# EAGLE design LB-w4-DOUBLE_AND_v02(rev2) (EAGLE 6.6.0)
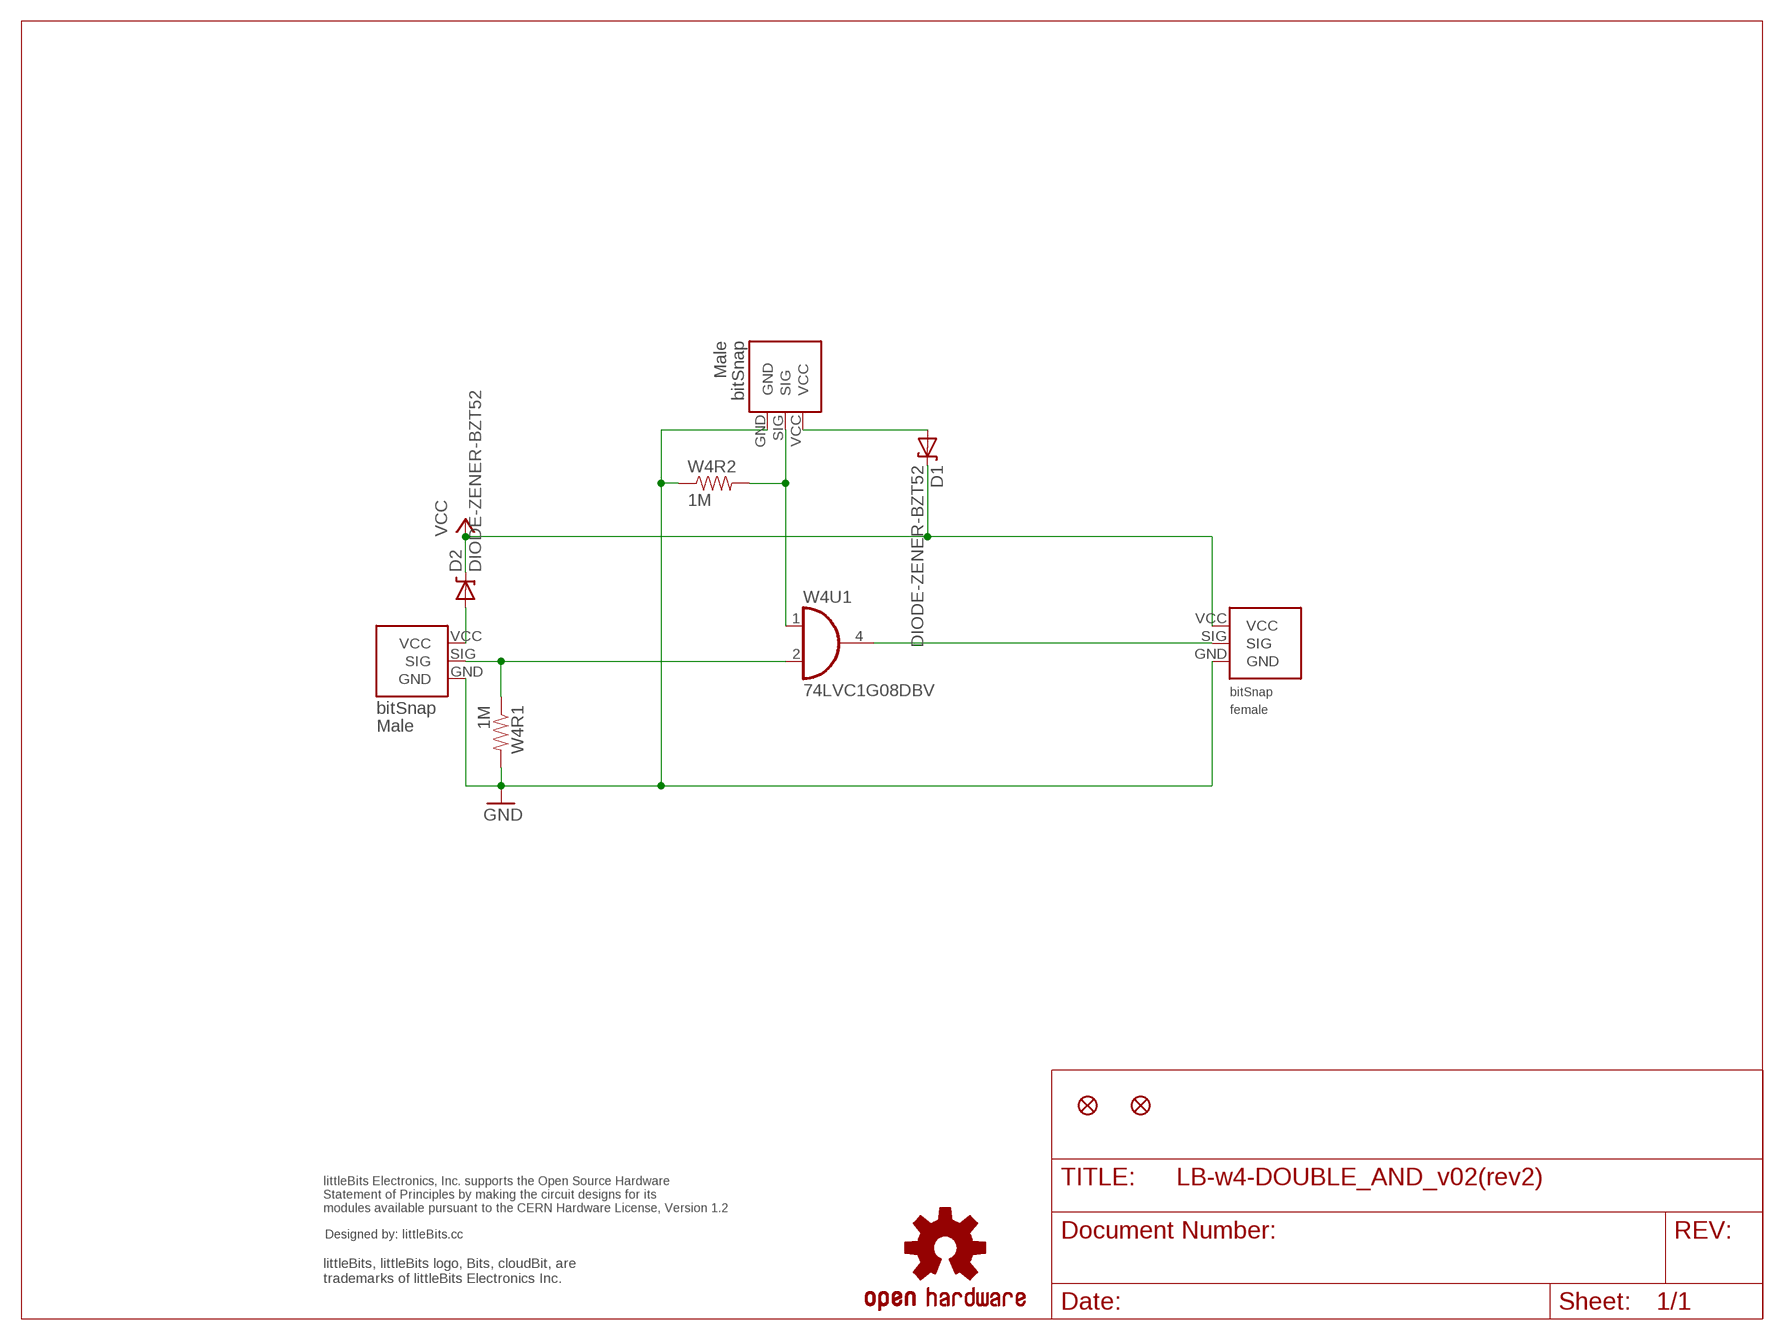
[diagram p0: schematic, sheet 1]

## Parts
D1  DIODE-ZENER-BZT52  [SOD-323]
D2  DIODE-ZENER-BZT52  [SOD-323]
U$1  OSHW-LOGOL  [OSHW-LOGO-L]
U$2  OSHWCREDIT  [OSHWCREDIT]
W4BSF  BITSNAP_FEMALE  [BITSNAP_FEMALE]
W4BSM1  BITSNAP_MALE  [BITSNAP_MALE]
W4BSM2  BITSNAP_MALE  [BITSNAP_MALE]
W4FD1  FIDUCIAL1X2  [FIDUCIAL-1X2]
W4FD2  FIDUCIAL1X2  [FIDUCIAL-1X2]
W4R1  1M  RESISTOR0603-RES  [0603-RES]
W4R2  1M  RESISTOR0603-RES  [0603-RES]
W4U1  74LVC1G08DBV  [SOT23-5]

## Nets
GND: W4BSF.GND W4BSM1.GND W4BSM2.GND W4R1.2 W4R2.1
N$1: W4BSF.SIG W4U1.4(O)
N$2: D1.2(A) W4BSM2.VCC
N$3: D2.2(A) W4BSM1.VCC
N$6: W4BSM2.SIG W4R2.2 W4U1.1(I0)
N$11: W4BSM1.SIG W4R1.1 W4U1.2(I1)
VCC: D1.1(C) D2.1(C) W4BSF.VCC

## Power pins joined to a net without a drawn wire
GND: W4U1.3(GND)
VCC: W4U1.5(VCC)

## Library data of the parts
D1 D2 = SparkFun:DIODE-ZENER: Zener Diode Production Part - 8199 3.4V Zener Voltage
U$1 = SparkFun_NEW:OSHW-LOGO: Open Source Hardware Logo This logo indicates the piece of hardware it is found on incorporates a OSHW license and/or adheres to the definition of open source hardware found here: http://freedomdefined.org/OSHW
U$2 = LITTLEBITS:OSHWCREDIT
W4BSF = bitSnap:BITSNAP_FEMALE
W4BSM1 W4BSM2 = bitSnap:BITSNAP_MALE
W4FD1 W4FD2 = SparkFun:FIDUCIAL: Fiducial Alignment Points Various fiducial points for machine vision alignment.
W4R1 W4R2 = SparkFun:RESISTOR: Resistor Basic schematic elements and footprints for 0603, 1206, and PTH 1/10th watt (small) resistors.
W4U1 = 74xx-little-de:74*1G08: 2-input AND gate

## Board
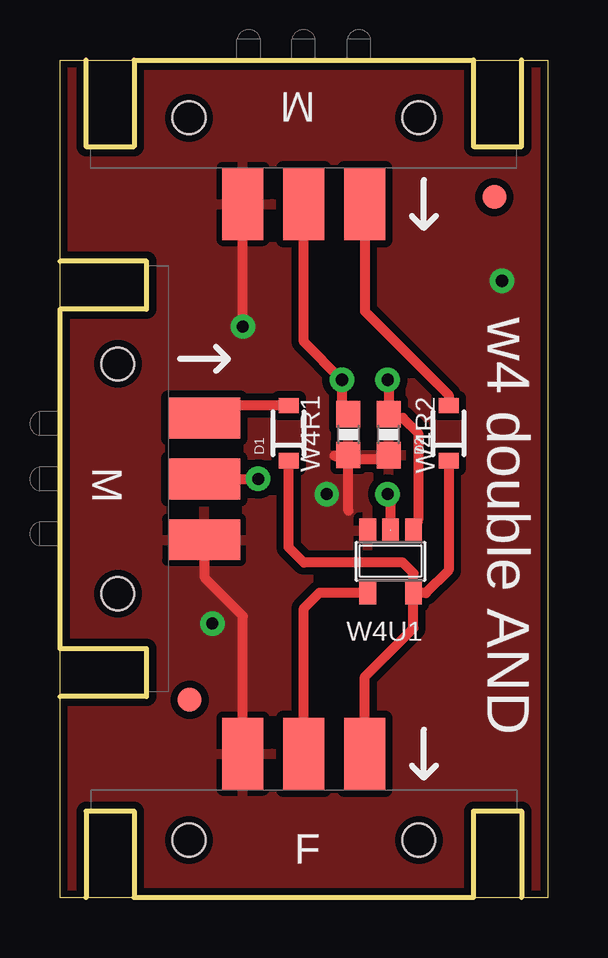
[diagram p1: board, top side]
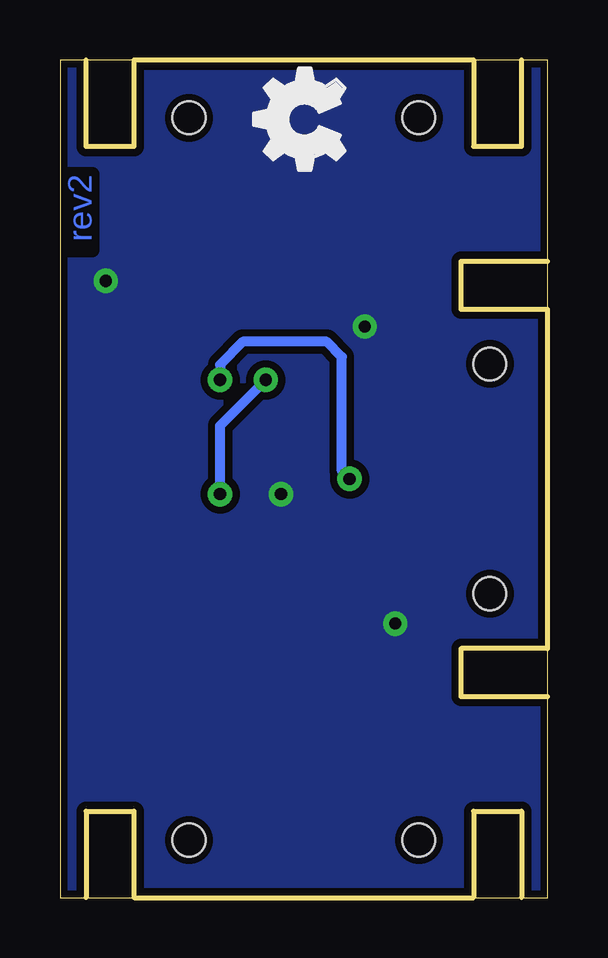
[diagram p2: board, bottom side, seen from below]

Size 20.32 x 34.92 mm. Coordinates in mm from the lower left corner, seen from the top.
Outline: 20.32,34.92 20.32,0 0,0 0,34.92 20.32,34.92
Copper layers (1*16): Top 0.035mm / dielectric 1.5mm / Bottom 0.035mm
Design rules "default": minimum track width 8mil, minimum drill 20mil, track to track 8mil, track to pad 8mil, pad to pad 8mil, via to via 8mil, smd to smd 8mil, copper to edge 10mil, drill to drill 8mil, minimum pad ring 12mil, minimum via ring 10mil, stop-mask expansion 4mil, vias tented up to drill 25mil, thermal gap 10mil

### Footprints (pad centres in the part's own frame; a part is rotated, then mirrored left to right if it is on the bottom)
SOD-323 = smd 0.63 x 0.83: 1 -1.15,0; 2 1.15,0
BITSNAP_FEMALE = smd 1.7 x 3: GND 6.35,6; SIG 8.89,6; VCC 11.43,6 | hole 1.37: 13.68,2.41; 4.1,2.41
BITSNAP_MALE = smd 1.7 x 3: GND 11.43,6; SIG 8.89,6; VCC 6.35,6 | hole 1.37: 13.68,2.41; 4.1,2.41
FIDUCIAL-1X2 = smd 1 x 1: 1 0,0
0603-RES = smd 1.1 x 1: 1 -0.85,0; 2 0.85,0
SOT23-5 = smd 0.69 x 0.99: 1 -0.95,-1.29; 2 0,-1.29; 3 0.95,-1.29; 4 0.95,1.3; 5 -0.95,1.3

### Placement (x,y rotation side)
D1  9.53,19.37 90 top
D2  16.19,19.37 90 top
U$1  -13.97,-10.16 0 top  (outside the outline)
U$2  -18.2,-21.7 0 top  (outside the outline)
U$15  [OSHW_FILLX150_NOTEXT]  8.45,29.5 0 top
W4BSF  1.27,0 0 top
W4BSM1  19.05,34.92 180 top
W4BSM2  0,26.35 270 top
W4FD1  18.1,29.21 0 top
W4FD2  5.4,8.26 0 top
W4R1  12.02,19.3 270 top
W4R2  13.69,19.3 90 top
W4U1  13.77,14.03 180 top

### Tracks (layer width: path | path; a pad name or v marks a point on that pad's centre or on a via)
GND  (via drill 0.51 pad 1.02)
  Top 0.406: W4R1.2 12.06,18.29 13.21,18.29 W4R2.1 | 12.02,16.12 W4R1.2 | W4BSF.GND 7.62,11.75 6.03,13.34 6.03,14.89 W4BSM2.GND | 7.62,24.13 W4BSM1.GND | 11.43,18.41 11.97,18.41 W4R1.2
  other vias: 6.35,11.43 18.41,25.72 11.11,16.83 7.62,23.81
  pour Top (isolate 0.305): 20,0.32 0.32,0.32 0.32,34.61 20,34.61
  pour Bottom (isolate 0.305): 0.32,34.61 20,34.61 20,0.32 0.32,0.32
N$1
  Top 0.406: W4U1.4 10.82,12.73 10.16,12.06 W4BSF.SIG
N$2
  Top 0.406: D1.2 6.55,20.52 6.03,20 W4BSM2.VCC
N$3
  Top 0.406: W4BSM1.VCC 12.7,24.45 16.19,20.95 D2.2
N$6  (via drill 0.51 pad 1.02)
  Top 0.406: W4U1.1 14.92,15.75 14.92,19.37 14.29,20 13.52,20 W4R2.2 13.69,21.55 v13.65,21.59 | W4BSM2.SIG v8.26,17.46
  Bottom 0.406: v13.65,21.59 13.65,22.23 12.7,23.18 9.21,23.18 8.57,22.54 8.57,17.78 v8.26,17.46
N$11  (via drill 0.51 pad 1.02)
  Top 0.406: W4U1.2 13.77,16.71 v13.65,16.83 | W4R1.1 11.75,20.32 v11.75,21.59 10.16,23.18 W4BSM1.SIG
  Bottom 0.406: v13.65,16.83 13.65,19.68 v11.75,21.59
VCC
  Top 0.406: W4U1.5 14.72,11.23 12.7,9.21 W4BSF.VCC | W4U1.5 14.72,13.54 14.29,13.97 10.16,13.97 9.53,14.61 D1.1 9.64,18.1 | D2.1 16.19,13.65 15.24,12.7 14.75,12.7 W4U1.5

### Text on the board
Bottom: rev2
tPlace: w4 double AND